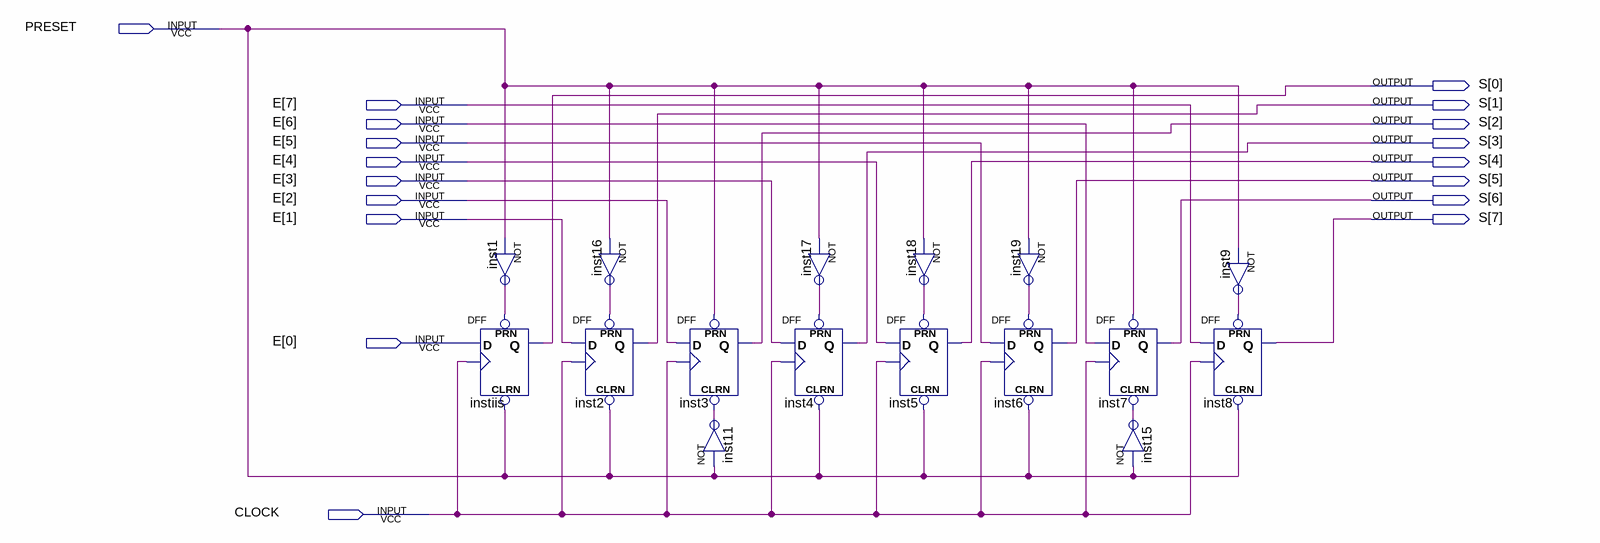
[diagram p0: schematic sheet]
// Quartus schematic linha_17.bdf as structural Verilog: 16 symbols, 18 pins
module linha_17 (
  input  PRESET,
  input  [7:0] E,
  input  CLOCK,
  output [7:0] S
);

  wire inst1_out, inst9_out, inst11_out, inst15_out, inst16_out, inst17_out, inst18_out, inst19_out;

  not inst1 (inst1_out, PRESET);
  DFF instiis (.CLRN(PRESET), .CLK(CLOCK), .D(E[0]), .PRN(inst1_out), .Q(S[0]));
  not inst16 (inst16_out, PRESET);
  DFF inst2 (.CLRN(PRESET), .CLK(CLOCK), .D(E[1]), .PRN(inst16_out), .Q(S[1]));
  DFF inst3 (.CLRN(inst11_out), .CLK(CLOCK), .D(E[2]), .PRN(PRESET), .Q(S[2]));
  not inst11 (inst11_out, PRESET);
  not inst17 (inst17_out, PRESET);
  DFF inst4 (.CLRN(PRESET), .CLK(CLOCK), .D(E[3]), .PRN(inst17_out), .Q(S[3]));
  not inst18 (inst18_out, PRESET);
  DFF inst5 (.CLRN(PRESET), .CLK(CLOCK), .D(E[4]), .PRN(inst18_out), .Q(S[4]));
  not inst19 (inst19_out, PRESET);
  DFF inst6 (.CLRN(PRESET), .CLK(CLOCK), .D(E[5]), .PRN(inst19_out), .Q(S[5]));
  DFF inst7 (.CLRN(inst15_out), .CLK(CLOCK), .D(E[6]), .PRN(PRESET), .Q(S[6]));
  not inst15 (inst15_out, PRESET);
  not inst9 (inst9_out, PRESET);
  DFF inst8 (.CLRN(PRESET), .CLK(CLOCK), .D(E[7]), .PRN(inst9_out), .Q(S[7]));
endmodule
